# EAGLE design Impression5-SMASH-Shield (EAGLE 9.4.2)
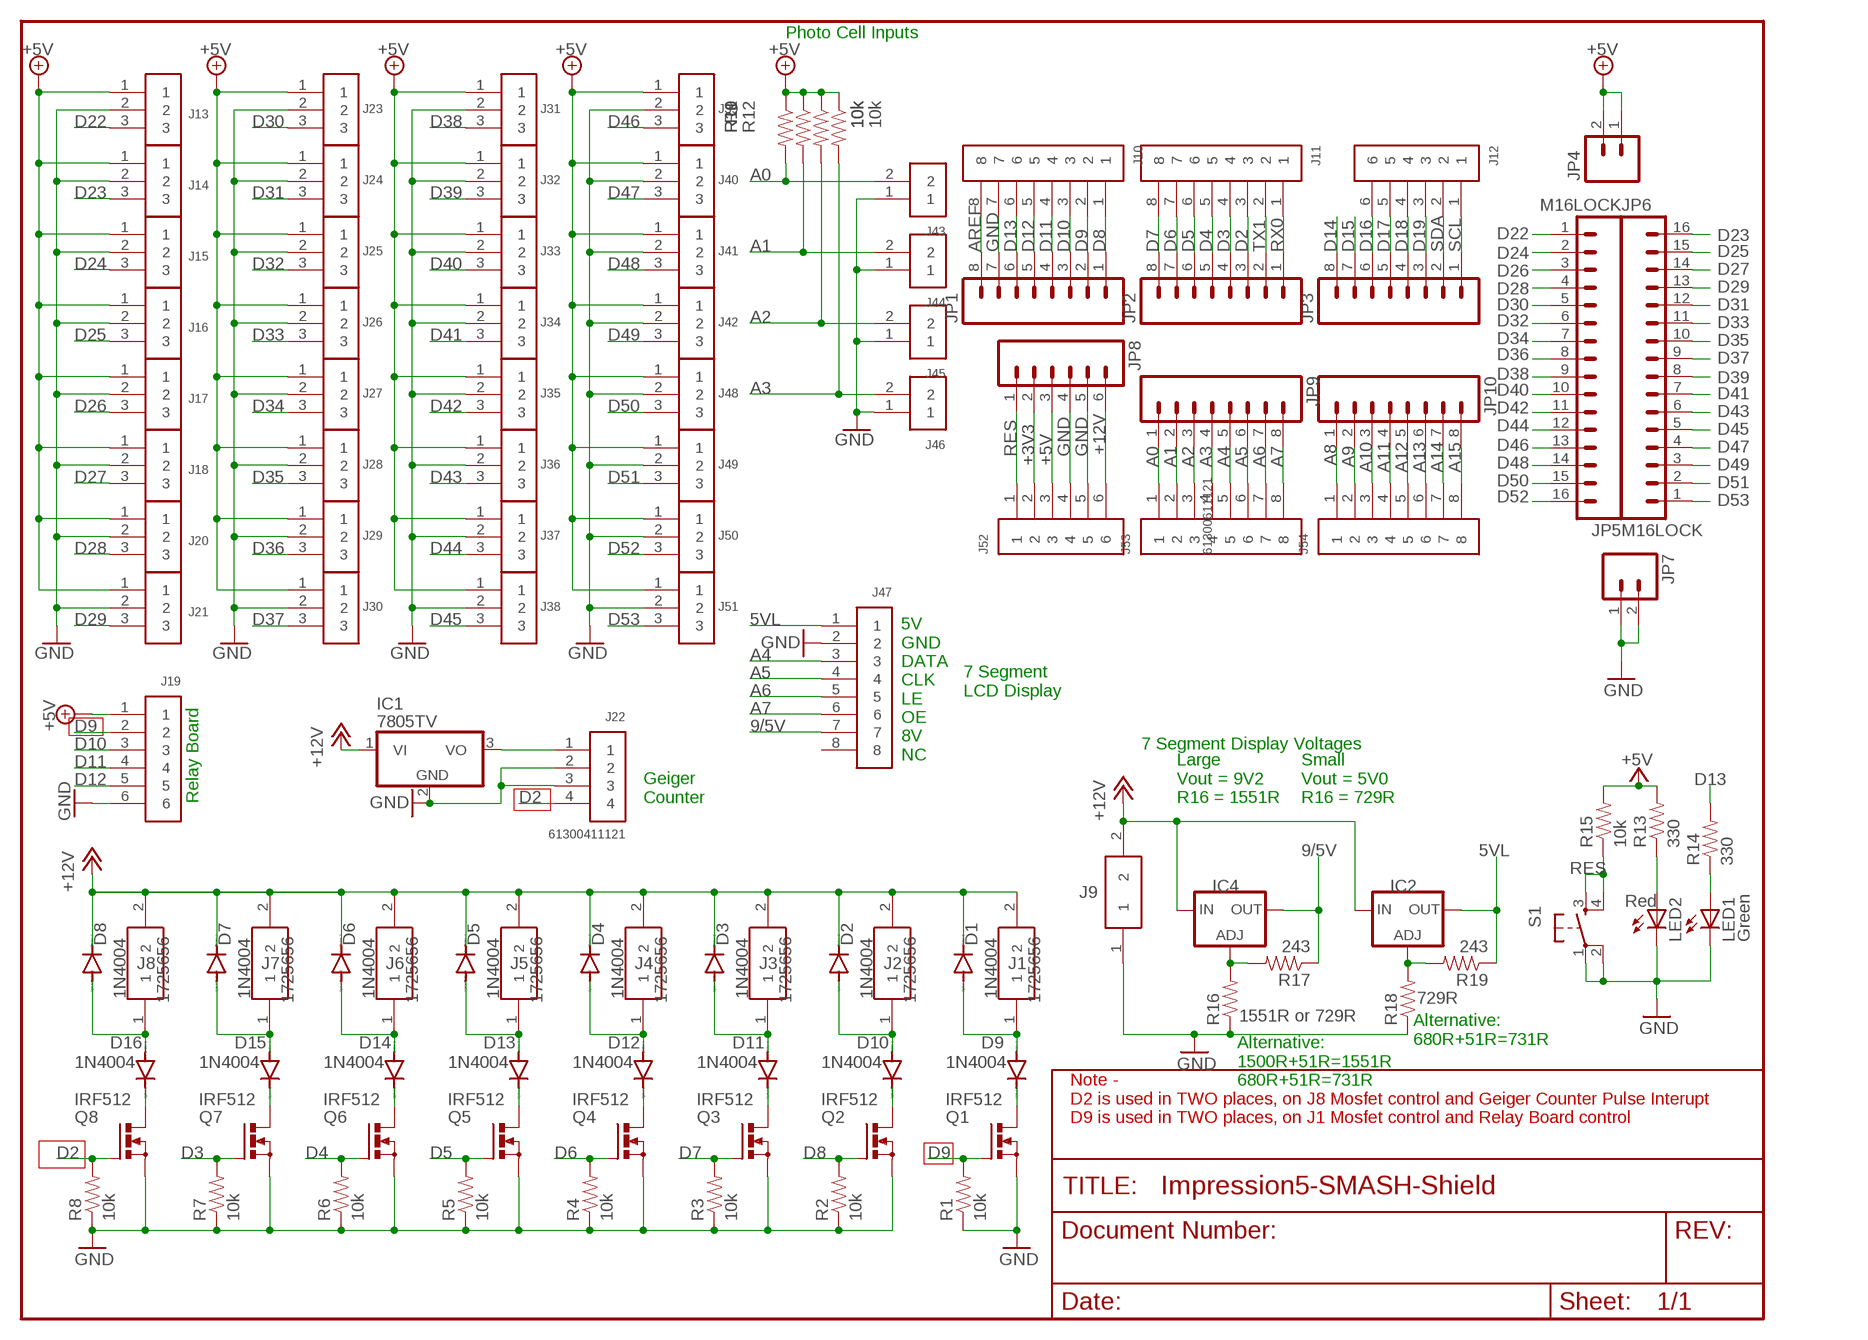
[diagram p0: schematic, sheet 1]

## Parts
D1  1N4004  [DO41-10]
D2  1N4004  [DO41-10]
D3  1N4004  [DO41-10]
D4  1N4004  [DO41-10]
D5  1N4004  [DO41-10]
D6  1N4004  [DO41-10]
D7  1N4004  [DO41-10]
D8  1N4004  [DO41-10]
D9  1N4004  [DO41-10]
D10  1N4004  [DO41-10]
D11  1N4004  [DO41-10]
D12  1N4004  [DO41-10]
D13  1N4004  [DO41-10]
D14  1N4004  [DO41-10]
D15  1N4004  [DO41-10]
D16  1N4004  [DO41-10]
IC1  7805TV  [TO220V]
IC2  LM317TS  [317TS]
IC4  LM317TS  [317TS]
J1  1725656  [1725656]
J2  1725656  [1725656]
J3  1725656  [1725656]
J4  1725656  [1725656]
J5  1725656  [1725656]
J6  1725656  [1725656]
J7  1725656  [1725656]
J8  1725656  [1725656]
J9  1725656  [1725656]
J10  61300811121  [61300811121]
J11  61300811121  [61300811121]
J12  61300611121  [61300611121]
J13  61300311121  [61300311121]
J14  61300311121  [61300311121]
J15  61300311121  [61300311121]
J16  61300311121  [61300311121]
J17  61300311121  [61300311121]
J18  61300311121  [61300311121]
J19  61300611121  [61300611121]
J20  61300311121  [61300311121]
J21  61300311121  [61300311121]
J22  61300411121  [61300411121]
J23  61300311121  [61300311121]
J24  61300311121  [61300311121]
J25  61300311121  [61300311121]
J26  61300311121  [61300311121]
J27  61300311121  [61300311121]
J28  61300311121  [61300311121]
J29  61300311121  [61300311121]
J30  61300311121  [61300311121]
J31  61300311121  [61300311121]
J32  61300311121  [61300311121]
J33  61300311121  [61300311121]
J34  61300311121  [61300311121]
J35  61300311121  [61300311121]
J36  61300311121  [61300311121]
J37  61300311121  [61300311121]
J38  61300311121  [61300311121]
J39  61300311121  [61300311121]
J40  61300311121  [61300311121]
J41  61300311121  [61300311121]
J42  61300311121  [61300311121]
J43  61300211121  [61300211121]
J44  61300211121  [61300211121]
J45  61300211121  [61300211121]
J46  61300211121  [61300211121]
J47  61300811121  [61300811121]
J48  61300311121  [61300311121]
J49  61300311121  [61300311121]
J50  61300311121  [61300311121]
J51  61300311121  [61300311121]
J52  61300611121  [61300611121]
J53  61300811121  [61300811121]
J54  61300811121  [61300811121]
JP1  M08LOCK  [1X08_LOCK]
JP2  M08LOCK  [1X08_LOCK]
JP3  M08LOCK  [1X08_LOCK]
JP4  M02LOCK  [1X02_LOCK]
JP5  M16LOCK  [1X16_LOCK]
JP6  M16LOCK  [1X16_LOCK]
JP7  M02LOCK  [1X02_LOCK]
JP8  M06LOCK  [1X06_LOCK]
JP9  M08LOCK  [1X08_LOCK]
JP10  M08LOCK  [1X08_LOCK]
LED1  Green  LED5MM  [LED5MM]
LED2  Red  LED5MM  [LED5MM]
Q1  IRF512  [TO220BV]
Q2  IRF512  [TO220BV]
Q3  IRF512  [TO220BV]
Q4  IRF512  [TO220BV]
Q5  IRF512  [TO220BV]
Q6  IRF512  [TO220BV]
Q7  IRF512  [TO220BV]
Q8  IRF512  [TO220BV]
R1  10k  RESISTORPTH1  [AXIAL-0.3]
R2  10k  RESISTORPTH1  [AXIAL-0.3]
R3  10k  RESISTORPTH1  [AXIAL-0.3]
R4  10k  RESISTORPTH1  [AXIAL-0.3]
R5  10k  RESISTORPTH1  [AXIAL-0.3]
R6  10k  RESISTORPTH1  [AXIAL-0.3]
R7  10k  RESISTORPTH1  [AXIAL-0.3]
R8  10k  RESISTORPTH1  [AXIAL-0.3]
R9  10k  RESISTORPTH1  [AXIAL-0.3]
R10  10k  RESISTORPTH1  [AXIAL-0.3]
R11  10k  RESISTORPTH1  [AXIAL-0.3]
R12  10k  RESISTORPTH1  [AXIAL-0.3]
R13  330  RESISTORPTH1  [AXIAL-0.3]
R14  330  RESISTORPTH1  [AXIAL-0.3]
R15  10k  RESISTORPTH1  [AXIAL-0.3]
R16  1551R or 729R  RESISTORPTH1  [AXIAL-0.3]
R17  243  RESISTORPTH1  [AXIAL-0.3]
R18  729R  RESISTORPTH1  [AXIAL-0.3]
R19  243  RESISTORPTH1  [AXIAL-0.3]
S1  TAC_SWITCHPTH  [TACTILE-PTH]

## Nets
5VG: IC1.3(VO) J22.1
5VL: IC2.2(OUT) J47.1 R19.P$1
9/5V: IC4.2(OUT) J47.7 R17.P$1
+3V3: J52.2 JP8.2
+5V: J13.1 J14.1 J15.1 J16.1 J17.1 J18.1 J19.1 J20.1 J21.1 J23.1 J24.1 J25.1 J26.1 J27.1 J28.1 J29.1 J30.1 J31.1 J32.1 J33.1 J34.1 J35.1 J36.1 J37.1 J38.1 J39.1 J40.1 J41.1 J42.1 J48.1 J49.1 J50.1 J51.1 J52.3 JP4.1 JP4.2 JP8.3 R9.P$1 R10.P$1 R11.P$1 R12.P$1 R13.P$2 R15.P$2
+12V: D1.C D2.C D3.C D4.C D5.C D6.C D7.C D8.C IC1.1(VI) IC2.3(IN) IC4.3(IN) J1.2 J2.2 J3.2 J4.2 J5.2 J6.2 J7.2 J8.2 J9.2 J52.6 JP8.6
A0: J43.2 J53.1 JP9.1 R9.P$2
A1: J44.2 J53.2 JP9.2 R10.P$2
A2: J45.2 J53.3 JP9.3 R11.P$2
A3: J46.2 J53.4 JP9.4 R12.P$2
A4: J47.3 J53.5 JP9.5
A5: J47.4 J53.6 JP9.6
A6: J47.5 J53.7 JP9.7
A7: J47.6 J53.8 JP9.8
A8: J54.1 JP10.1
A9: J54.2 JP10.2
A10: J54.3 JP10.3
A11: J54.4 JP10.4
A12: J54.5 JP10.5
A13: J54.6 JP10.6
A14: J54.7 JP10.7
A15: J54.8 JP10.8
AREF: J10.8 JP1.8
D2: J11.3 J22.4 JP2.3 Q8.G R8.P$2
D3: J11.4 JP2.4 Q7.G R7.P$2
D4: J11.5 JP2.5 Q6.G R6.P$2
D5: J11.6 JP2.6 Q5.G R5.P$2
D6: J11.7 JP2.7 Q4.G R4.P$2
D7: J11.8 JP2.8 Q3.G R3.P$2
D8: J10.1 JP1.1 Q2.G R2.P$2
D9: J10.2 J19.2 JP1.2 Q1.G R1.P$2
D10: J10.3 J19.3 JP1.3
D11: J10.4 J19.4 JP1.4
D12: J10.5 J19.5 JP1.5
D13: J10.6 JP1.6 R14.P$2
D14: JP3.8
D15: JP3.7
D16: J12.6 JP3.6
D17: J12.5 JP3.5
D18: J12.4 JP3.4
D19: J12.3 JP3.3
D22: J13.3 JP5.1
D23: J14.3 JP6.16
D24: J15.3 JP5.2
D25: J16.3 JP6.15
D26: J17.3 JP5.3
D27: J18.3 JP6.14
D28: J20.3 JP5.4
D29: J21.3 JP6.13
D30: J23.3 JP5.5
D31: J24.3 JP6.12
D32: J25.3 JP5.6
D33: J26.3 JP6.11
D34: J27.3 JP5.7
D35: J28.3 JP6.10
D36: J29.3 JP5.8
D37: J30.3 JP6.9
D38: J31.3 JP5.9
D39: J32.3 JP6.8
D40: J33.3 JP5.10
D41: J34.3 JP6.7
D42: J35.3 JP5.11
D43: J36.3 JP6.6
D44: J37.3 JP5.12
D45: J38.3 JP6.5
D46: J39.3 JP5.13
D47: J40.3 JP6.4
D48: J41.3 JP5.14
D49: J42.3 JP6.3
D50: J48.3 JP5.15
D51: J49.3 JP6.2
D52: J50.3 JP5.16
D53: J51.3 JP6.1
GND: IC1.2(GND) J9.1 J10.7 J13.2 J14.2 J15.2 J16.2 J17.2 J18.2 J19.6 J20.2 J21.2 J22.2 J22.3 J23.2 J24.2 J25.2 J26.2 J27.2 J28.2 J29.2 J30.2 J31.2 J32.2 J33.2 J34.2 J35.2 J36.2 J37.2 J38.2 J39.2 J40.2 J41.2 J42.2 J43.1 J44.1 J45.1 J46.1 J47.2 J48.2 J49.2 J50.2 J51.2 J52.4 J52.5 JP1.7 JP7.1 JP7.2 JP8.4 JP8.5 LED1.K(C) LED2.K(C) Q1.S Q2.S Q3.S Q4.S Q5.S Q6.S Q7.S Q8.S R1.P$1 R2.P$1 R3.P$1 R4.P$1 R5.P$1 R6.P$1 R7.P$1 R8.P$1 R16.P$1 R18.P$1 S1.1 S1.2
N$2: D8.A D16.A J8.1
N$3: D16.C Q8.D
N$5: D7.A D15.A J7.1
N$6: D15.C Q7.D
N$8: D6.A D14.A J6.1
N$9: D14.C Q6.D
N$11: D5.A D13.A J5.1
N$12: D13.C Q5.D
N$14: D4.A D12.A J4.1
N$15: D12.C Q4.D
N$17: D3.A D11.A J3.1
N$18: D11.C Q3.D
N$20: D2.A D10.A J2.1
N$21: D10.C Q2.D
N$23: D1.A D9.A J1.1
N$24: D9.C Q1.D
N$31: IC4.1(ADJ) R16.P$2 R17.P$2
N$41: IC2.1(ADJ) R18.P$2 R19.P$2
N$126: LED2.A R13.P$1
N$127: LED1.A R14.P$1
RES: J52.1 JP8.1 R15.P$1 S1.3 S1.4
RX0: J11.1 JP2.1
SCL: J12.1 JP3.1
SDA: J12.2 JP3.2
TX1: J11.2 JP2.2
Unconnected: J47.8

## Notes on the sheet
- Photo Cell Inputs
- 7 Segment
  LCD Display
- 7 Segment Display Voltages
- 5V
  GND
  DATA
  CLK
  LE
  OE
  8V
  NC
- Relay Board
- Geiger
  Counter
- Large
  Vout = 9V2
  R16 = 1551R
- Small
  Vout = 5V0
  R16 = 729R
- Alternative:
  680R+51R=731R
- Alternative:
  1500R+51R=1551R
  680R+51R=731R
- Note -
  D2 is used in TWO places, on J8 Mosfet control and Geiger Counter Pulse Interupt
  D9 is used in TWO places, on J1 Mosfet control and Relay Board control

## Library data of the parts
D1-D16 = diode:1N4004: DIODE general purpose rectifier, 1 A
IC1 = linear:78*: Positive VOLTAGE REGULATOR Source: http://cache.national.com/ds/LM/LM78L05.pdf http://www.fairchildsemi.com/ds/LM/LM7805.pdf
IC2 IC4 = v-reg:LM317TS: VOLTAGE REGULATOR
J1-J9 = SamacSys_Parts:1725656: 2 way PCB vertical mount terminal,2.54mm 2 way PCB vertical mount terminal,2.54mm Source: Datasheet <https://www.phoenixcontact.com/online/portal/gb?uri=pxc-oc-itemdetail:pid=1725656&library=gben&tab=1>; ALLIED_NUMBER: 70054335; ALLIED_PRICE-STOCK: http://www.alliedelec.com/phoenix-contact-1725656/70054335/; DESCRIPTION: 2 way PCB vertical mount terminal,2.54mm 2 way PCB vertical mount terminal,2.54mm; HEIGHT: 8mm; MANUFACTURER_NAME: Phoenix Contact; MANUFACTURER_PART_NUMBER: 1725656; MOUSER_PART_NUMBER: 651-1725656; MOUSER_PRICE-STOCK: https://www.mouser.com/Search/Refine.aspx?Keyword=651-1725656; RS_PART_NUMBER: 3909023; RS_PRICE-STOCK: https://uk.rs-online.com/web/p/products/3909023
J10 J11 J47 J53 J54 = Headers:61300811121: CONN HEADER VERT 8POS 2.54MM Manufacturer's datasheet <https://katalog.we-online.de/em/datasheet/6130xx11121.pdf>; CREATED_BY: PCBLayout.com; DIGI_KEY_PART_NUMBER: 732-5321-ND; MANUFACTURER: Wurth Electronics Inc.; MPN: 61300811121
J12 J19 J52 = Headers:61300611121: CONN HEADER VERT 6POS 2.54MM Manufacturer's datasheet <https://katalog.we-online.de/em/datasheet/6130xx11121.pdf>; CREATED_BY: PCBLayout.com; DIGI_KEY_PART_NUMBER: 732-5319-ND; MANUFACTURER: Wurth Electronics Inc.; MPN: 61300611121
J13-J18 J20 J21 J23-J42 J48-J51 = Headers:61300311121: CONN HEADER VERT 3POS 2.54MM Manufacturer's datasheet <https://katalog.we-online.de/em/datasheet/6130xx11121.pdf>; CREATED_BY: PCBLayout.com; DIGI_KEY_PART_NUMBER: 732-5316-ND; MANUFACTURER: Wurth Electronics Inc.; MPN: 61300311121
J22 = Headers:61300411121: CONN HEADER VERT 4POS 2.54MM Manufacturer's datasheet <https://katalog.we-online.de/em/datasheet/6130xx11121.pdf>; CREATED_BY: PCBLayout.com; DIGI_KEY_PART_NUMBER: 732-5317-ND; MANUFACTURER: Wurth Electronics Inc.; MPN: 61300411121
J43-J46 = Headers:61300211121: CONN HEADER VERT 2POS 2.54MM Manufacturer's datasheet <https://katalog.we-online.de/em/datasheet/6130xx11121.pdf>; CREATED_BY: PCBLayout.com; DIGI_KEY_PART_NUMBER: 732-5315-ND; MANUFACTURER: Wurth Electronics Inc.; MPN: 61300211121
JP1-JP3 JP9 JP10 = SparkFun:M08: Header 8 Standard 8-pin 0.1" header. Use with straight break away headers (SKU : PRT-00116), right angle break away headers (PRT-00553), swiss pins (PRT-00743), machine pins (PRT-00117), and female headers (PRT-00115).
JP4 JP7 = SparkFun:M02: Header 2 Standard 2-pin 0.1" header. Use with straight break away headers (SKU : PRT-00116), right angle break away headers (PRT-00553), swiss pins (PRT-00743), machine pins (PRT-00117), and female headers (PRT-00115). Molex polarized connector foot print use with SKU : PRT-08233 with associated crimp pins and housings.
JP5 JP6 = SparkFun:M16
JP8 = SparkFun:M06: Header 6 Standard 6-pin 0.1" header. Use with straight break away headers (SKU : PRT-00116), right angle break away headers (PRT-00553), swiss pins (PRT-00743), machine pins (PRT-00117), and female headers (PRT-00115). Molex polarized connector foot print use with SKU : PRT-08094 with associated crimp pins and housings. NOTES ON THE VARIANTS LOCK and LOCK_LONGPADS... This footprint was designed to help hold the alignment of a through-hole component (i.e. 6-pin header) while soldering it into place. You may notice that each hole has been shifted either up or down by 0.005 of an inch from it's more standard position (which is a perfectly straight line). This slight alteration caused the pins (the squares in the middle) to touch the edges of the holes. Because they are alternating, it causes a "brace" to hold the component in place. 0.005 has proven to be the perfect amount of "off-center" position when using our standard breakaway headers. Although looks a little odd when you look at the bare footprint, once you have a header in there, the alteration is very hard to notice. Also, if you push a header all the way into place, it is covered up entirely on the bottom side. This idea of altering the position of holes to aid alignment will be further integrated into the Sparkfun Library for other footprints. It can help hold any component with 3 or more connection pins.
LED1 LED2 = SparkFun:LED: LEDs Standard schematic elements and footprints for 5mm, 3mm, 1206, and 0603 sized LEDs. 5mm - Spark Fun Electronics SKU : COM-00529 (and others)
Q1-Q8 = transistor-power:IRF512: N-CHANNEL MOS FET
R1-R19 = SparkFun:RESISTOR: Resistor Basic schematic elements and footprints for 0603, 1206, and PTH 1/10th watt (small) resistors.
S1 = SparkFun:TAC_SWITCH: Momentary Switch Button commonly used for reset or general input. Spark Fun Electronics SKU : COM-00097

## Board
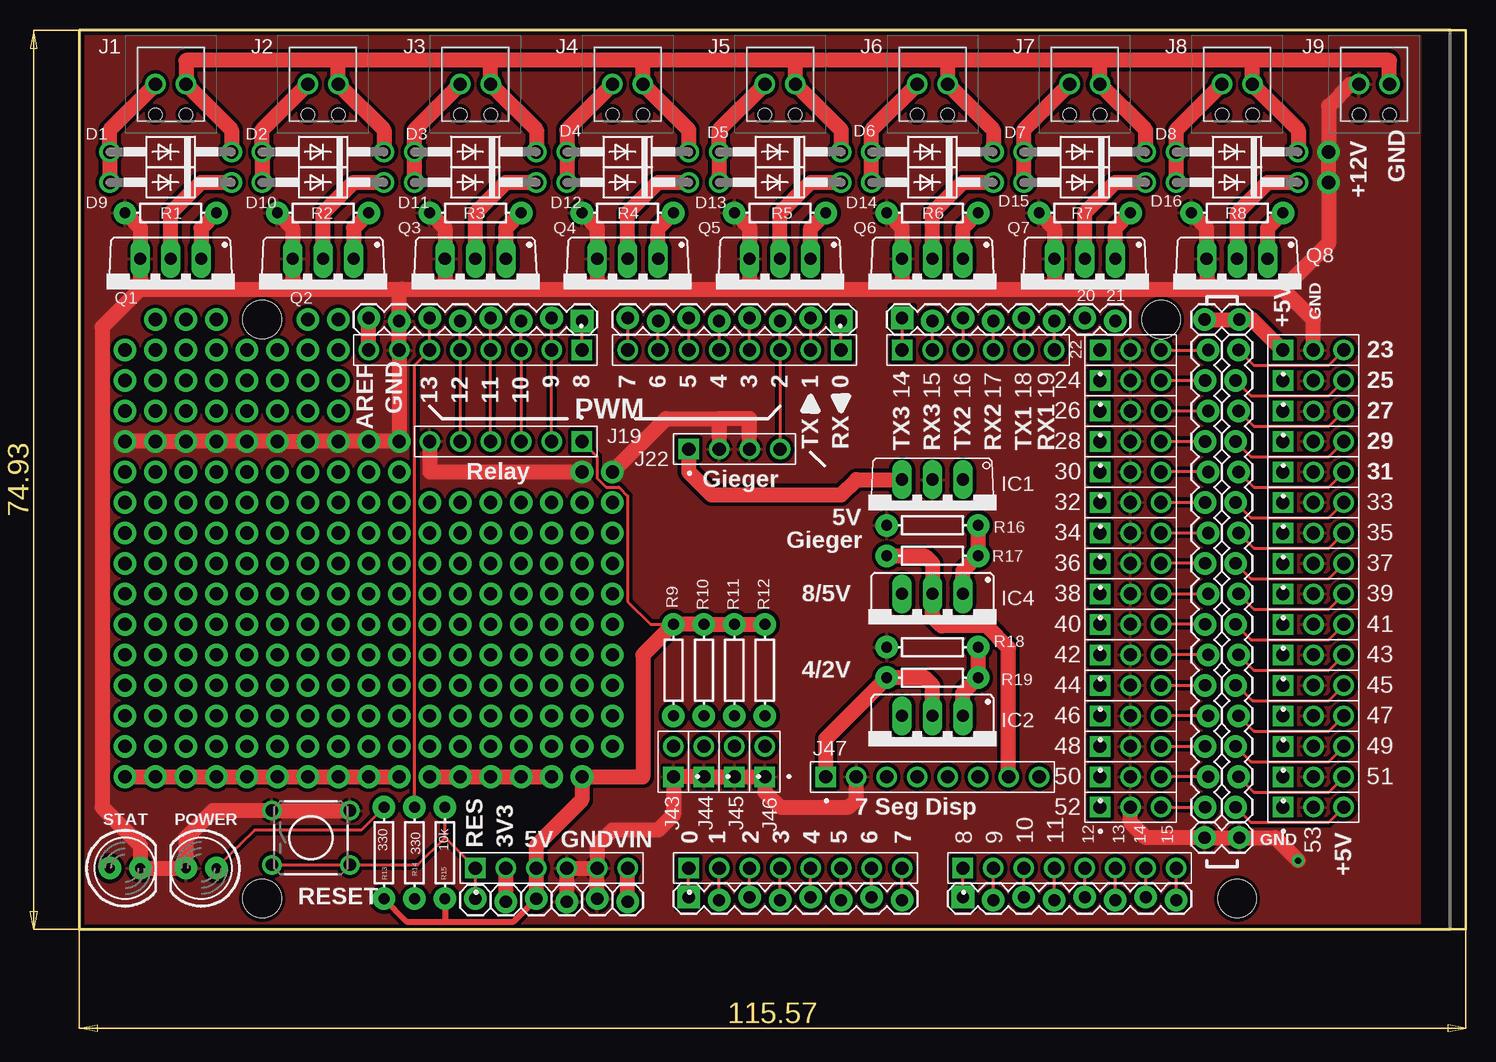
[diagram p1: board, top side]
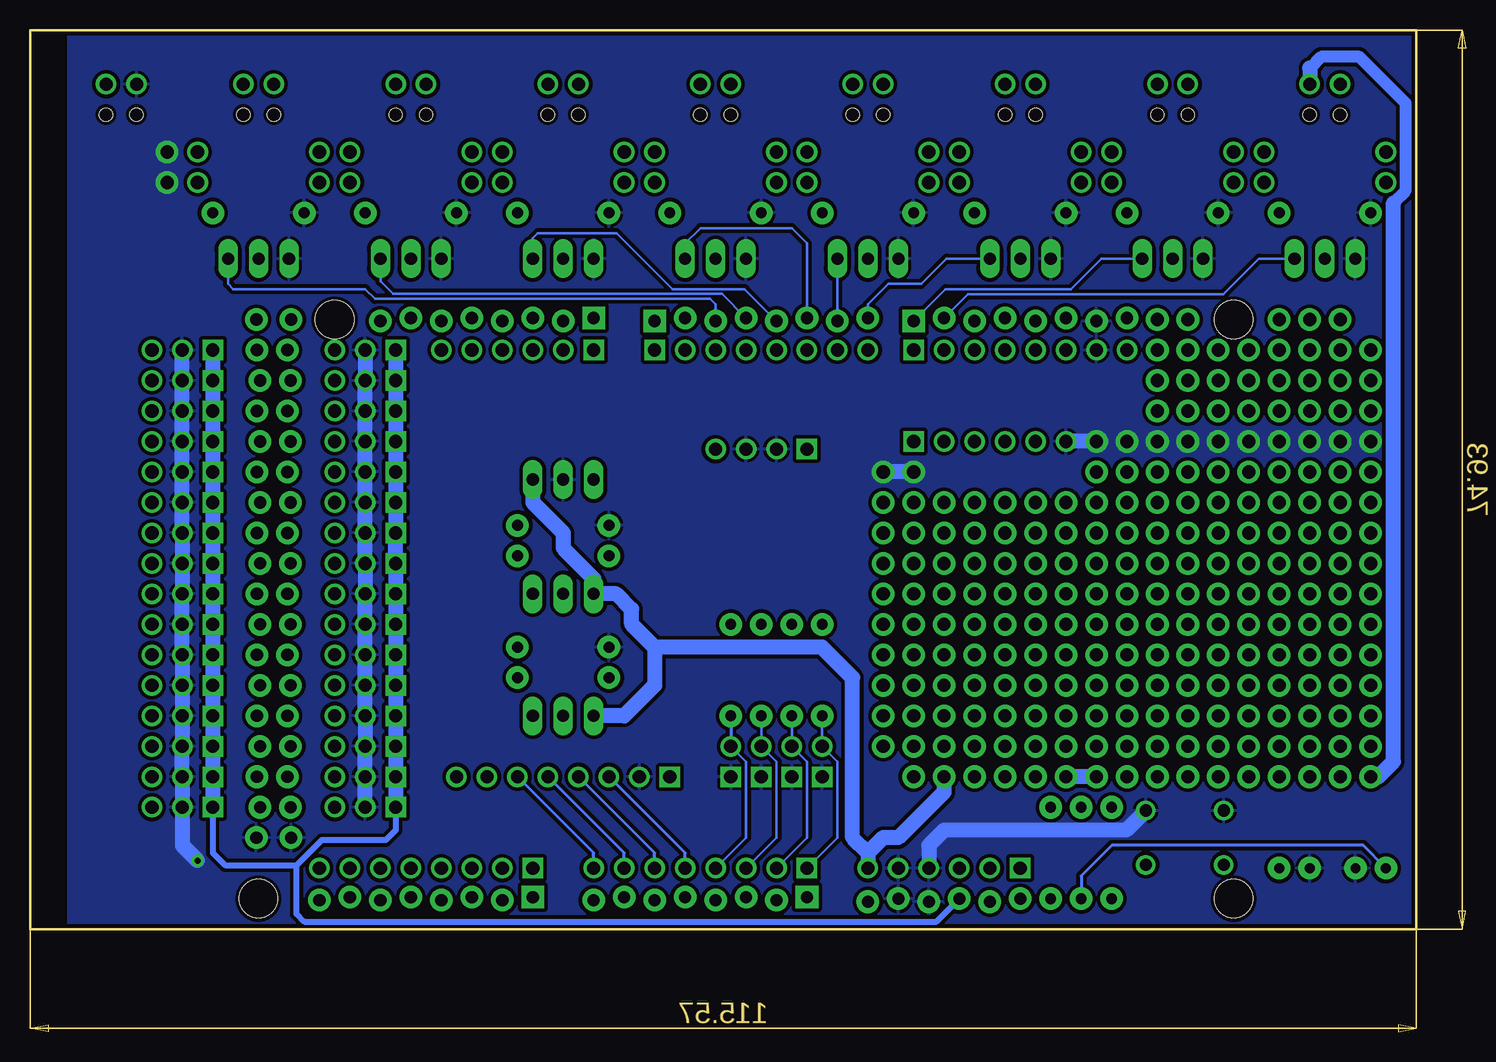
[diagram p2: board, bottom side, seen from below]

Size 115.57 x 74.93 mm. Coordinates in mm from the lower left corner, seen from the top.
Outline: 0,0 115.57,0 115.57,74.93 0,74.93 0,0
Copper layers (1*16): Top 0.035mm / dielectric 1.5mm / Bottom 0.035mm
Design rules "SparkFun *": minimum track width 8mil, minimum drill 20mil, track to track 8mil, track to pad 8mil, pad to pad 8mil, via to via 8mil, smd to smd 8mil, copper to edge 10mil, drill to drill 8mil, minimum pad ring 12mil, minimum via ring 10mil, stop-mask expansion 4mil, vias tented up to drill 25mil, thermal gap 10mil
Holes 3.2 mm at 15.24,50.8 15.24,2.54 90.17,50.8 96.52,2.54

### Footprints (pad centres in the part's own frame; a part is rotated, then mirrored left to right if it is on the bottom)
DO41-10 = drill 1.118: A 5.08,0; C -5.08,0
TO220V = drill 1.016 long: 1 -2.54,-2.54; 2 0,-2.54; 3 2.54,-2.54
317TS = drill 1.016 long: 1 -2.54,-2.54; 2 0,-2.54; 3 2.54,-2.54
1725656 = drill 1.1 pad 1.65: 1 -1.27,3.1; 2 1.27,3.1 | hole 1.1: -1.27,0.56; 1.27,0.56
61300811121 = drill 1.1 square: 1 -8.89,0 | drill 1.1: 2 -6.35,0; 3 -3.81,0; 4 -1.27,0; 5 1.27,0; 6 3.81,0; 7 6.35,0; 8 8.89,0
61300611121 = drill 1.1 square: 1 -6.35,0 | drill 1.1: 2 -3.81,0; 3 -1.27,0; 4 1.27,0; 5 3.81,0; 6 6.35,0
61300311121 = drill 1.1 square: 1 -2.54,0 | drill 1.1: 2 0,0; 3 2.54,0
61300411121 = drill 1.1 square: 1 -3.81,0 | drill 1.1: 2 -1.27,0; 3 1.27,0; 4 3.81,0
61300211121 = drill 1.1 square: 1 -1.27,0 | drill 1.1: 2 1.27,0
1X08_LOCK = drill 1.016 pad 1.88 square: 1 0,0.127 | drill 1.016 pad 1.88: 2 2.54,-0.127; 3 5.08,0.127; 4 7.62,-0.127; 5 10.16,0.127; 6 12.7,-0.127; 7 15.24,0.127; 8 17.78,-0.127
1X02_LOCK = drill 1.016 pad 1.88: 1 -0.178,0; 2 2.718,0
1X16_LOCK = drill 1.016 pad 1.88: 1 0,0.127; 2 2.54,-0.127; 3 5.08,0.127; 4 7.62,-0.127; 5 10.16,0.127; 6 12.7,-0.127; 7 15.24,0.127; 8 17.78,-0.127; 9 20.32,0.127; 10 22.86,-0.127; 11 25.4,0.127; 12 27.94,-0.127; 13 30.48,0.127; 14 33.02,-0.127; 15 35.56,0.127; 16 38.1,-0.127
1X06_LOCK = drill 1.016 pad 1.88: 1 0,0; 2 2.54,-0.254; 3 5.08,0; 4 7.62,-0.254; 5 10.16,0; 6 12.7,-0.254
LED5MM = drill 0.813 pad 1.88: A -1.27,0; K 1.27,0
TO220BV = drill 1.016 long: D 0,-2.54; G -2.54,-2.54; S 2.54,-2.54
AXIAL-0.3 = drill 0.9 pad 1.88: P$1 -3.81,0; P$2 3.81,0
TACTILE-PTH = drill 1.016: 1 -3.251,2.261; 2 3.251,2.261; 3 -3.251,-2.261; 4 3.251,-2.261

### Placement (x,y rotation side)
D1  7.62,64.77 180 top
D2  20.32,64.77 180 top
D3  33.02,64.77 180 top
D4  45.72,64.77 180 top
D5  58.42,64.77 180 top
D6  71.12,64.77 180 top
D7  83.82,64.77 180 top
D8  96.52,64.77 180 top
D9  7.62,62.23 180 top
D10  20.32,62.23 180 top
D11  33.02,62.23 180 top
D12  45.72,62.23 180 top
D13  58.42,62.23 180 top
D14  71.12,62.23 180 top
D15  83.82,62.23 180 top
D16  96.52,62.23 180 top
IC1  71.12,34.92 180 top
IC2  71.12,15.24 180 top
IC4  71.12,25.4 180 top
J1  7.62,67.31 0 top
J2  20.32,67.31 0 top
J3  33.02,67.31 0 top
J4  45.72,67.31 0 top
J5  58.42,67.31 0 top
J6  71.12,67.31 0 top
J7  83.82,67.31 0 top
J8  96.52,67.31 0 top
J9  107.95,67.31 0 top
J10  33.02,48.26 180 top
J11  54.61,48.26 180 top
J12  74.93,48.26 0 top
J13  87.63,48.26 0 top
J14  102.87,48.26 0 top
J15  87.63,45.72 0 top
J16  102.87,45.72 0 top
J17  87.63,43.18 0 top
J18  102.87,43.18 0 top
J19  35.56,40.64 180 top
J20  87.63,40.64 0 top
J21  102.87,40.64 0 top
J22  54.61,40.01 0 top
J23  87.63,38.1 0 top
J24  102.87,38.1 0 top
J25  87.63,35.56 0 top
J26  102.87,35.56 0 top
J27  87.63,33.02 0 top
J28  102.87,33.02 0 top
J29  87.63,30.48 0 top
J30  102.87,30.48 0 top
J31  87.63,27.94 0 top
J32  102.87,27.94 0 top
J33  87.63,25.4 0 top
J34  102.87,25.4 0 top
J35  87.63,22.86 0 top
J36  102.87,22.86 0 top
J37  87.63,20.32 0 top
J38  102.87,20.32 0 top
J39  87.63,17.78 0 top
J40  102.87,17.78 0 top
J41  87.63,15.24 0 top
J42  102.87,15.24 0 top
J43  49.53,13.97 90 top
J44  52.07,13.97 90 top
J45  54.61,13.97 90 top
J46  57.15,13.97 90 top
J47  71.12,12.7 0 top
J48  87.63,12.7 0 top
J49  102.87,12.7 0 top
J50  87.63,10.16 0 top
J51  102.87,10.16 0 top
J52  39.37,5.08 0 top
J53  59.69,5.08 0 top
J54  82.55,5.08 0 top
JP1  41.91,50.8 180 top
JP2  63.5,50.8 180 top
JP3  68.58,50.8 0 top
JP4  93.98,50.8 0 top
JP5  93.98,48.26 270 top
JP6  96.52,10.16 90 top
JP7  93.98,7.62 0 top
JP8  33.02,2.54 0 top
JP9  50.8,2.54 0 top
JP10  73.66,2.54 0 top
LED1  3.81,5.08 0 top
LED2  10.16,5.08 180 top
Q1  7.62,53.34 180 top
Q2  20.32,53.34 180 top
Q3  33.02,53.34 180 top
Q4  45.72,53.34 180 top
Q5  58.42,53.34 180 top
Q6  71.12,53.34 180 top
Q7  83.82,53.34 180 top
Q8  96.52,53.34 180 top
R1  7.62,59.69 0 top
R2  20.32,59.69 0 top
R3  33.02,59.69 0 top
R4  45.72,59.69 0 top
R5  58.42,59.69 0 top
R6  71.12,59.69 0 top
R7  83.82,59.69 0 top
R8  96.52,59.69 0 top
R9  49.53,21.59 270 top
R10  52.07,21.59 270 top
R11  54.61,21.59 270 top
R12  57.15,21.59 270 top
R13  25.4,6.35 270 top
R14  27.94,6.35 90 top
R15  30.48,6.35 270 top
R16  71.12,33.66 0 top
R17  71.12,31.11 0 top
R18  71.12,23.5 0 top
R19  71.12,20.95 0 top
S1  19.3,7.62 0 top

### Tracks (layer width: path | path; a pad name or v marks a point on that pad's centre or on a via)
5VG
  Top 1.27: J22.1 50.8,38.1 52.7,36.2 63.5,36.2 64.77,37.47 IC1.3
5VL
  Top 1.27: IC2.2 71.12,20.32 70.48,20.95 R19.P$1 62.23,15.88 J47.1
9/5V
  Top 1.27: R17.P$1 70.48,31.11 71.12,30.48 IC4.2 71.12,26.04 71.88,25.27 75.67,25.27 77.47,23.47 J47.7
+3V3
  Top 1.27: JP8.2 J52.2
+5V  (via drill 1.1 pad 1.88)
  Top 0.254: R9.P$1 47.62,25.4 45.72,27.3 45.72,36.09 44.98,36.83 43.92,36.83 43.18,37.57 43.18,39.37 J19.1
  Top 0.508: R13.P$2 27.3,0.64 30.48,0.64 | JP8.3 36.2,0.64 30.48,0.64 | R15.P$2 30.48,0.64
  Top 1.27: JP4.1 JP4.2 97.79,50.8 J14.1 | JP8.3 J52.3 38.1,6.99 41.91,10.79 v41.91,12.7 46.99,12.7 46.99,22.86 R9.P$1 R10.P$1 R11.P$1 R12.P$1
  Bottom 0.508: 93.34,5.33 91.25,7.43 85.92,7.43 85.09,8.26 J50.1 | 93.34,5.33 93.34,1.27 92.71,0.64 40.01,0.64 JP8.3 | J51.1 100.33,6.35 99.31,5.33 93.34,5.33
  Bottom 1.27: J13.1 J15.1 J17.1 J20.1 J23.1 J25.1 J27.1 J29.1 J31.1 J33.1 J35.1 J37.1 J39.1 J41.1 J48.1 J50.1 | J14.1 J16.1 J18.1 J21.1 J24.1 J26.1 J28.1 J30.1 J32.1 J34.1 J36.1 J38.1 J40.1 J42.1 J49.1 J51.1
+12V  (via drill 1.1 pad 1.88)
  Top 1.27: D1.C 12.7,66.6 J1.2 8.89,72.39 21.59,72.39 | D2.C 25.4,66.6 J2.2 21.59,72.39 | D3.C 38.1,66.6 J3.2 34.29,72.39 | D4.C 50.8,66.6 J4.2 46.99,72.39 | D5.C 63.5,66.6 J5.2 59.69,72.39 | D6.C 76.2,66.6 J6.2 72.39,72.39 | D7.C 88.9,66.6 J7.2 85.09,72.39 | D8.C 101.6,66.6 J8.2 97.79,72.39 | 97.79,72.39 85.09,72.39 | 85.09,72.39 72.39,72.39 | 72.39,72.39 59.69,72.39 | 59.69,72.39 46.99,72.39 | 46.99,72.39 34.29,72.39 | 34.29,72.39 21.59,72.39 | J9.2 109.22,72.39 97.79,72.39 | JP8.6 J52.6 | v3.81,12.7 v6.35,12.7 v8.89,12.7 v11.43,12.7 v13.97,12.7 v16.51,12.7 v19.05,12.7 v21.59,12.7 v24.13,12.7 v26.67,12.7 | v29.21,12.7 v31.75,12.7 v34.29,12.7 v36.83,12.7 v39.37,12.7
  Bottom 1.016: 1.91,60.53 0.89,61.55 0.89,68.83 4.74,72.69 7.96,72.69 8.89,71.75
  Bottom 1.27: 1.91,60.53 1.91,13.97 3.17,12.7 v3.81,12.7 | 8.89,71.75 J1.2 | v39.37,12.7 39.37,11.43 43.18,7.62 44.45,7.62 45.72,6.35 | 45.72,6.35 J52.6 | v26.67,12.7 v29.21,12.7 | 45.72,6.35 46.99,7.62 46.99,20.95 49.53,23.5 63.5,23.5 | 63.5,23.5 65.41,25.4 65.41,26.67 66.67,27.94 IC4.3 68.58,29.21 71.12,31.75 71.12,33.02 73.66,35.56 IC1.1 | 63.5,23.5 63.5,20.32 66.04,17.78 IC2.3
A0
  Top 0.254: JP9.1 J53.1
  Bottom 0.203: R9.P$2 J43.2 48.26,13.97 48.26,7.62 J53.1
A1
  Top 0.254: JP9.2 J53.2
  Bottom 0.203: R10.P$2 J44.2 50.8,13.97 50.8,7.62 J53.2
A2
  Top 0.254: JP9.3 J53.3
  Bottom 0.203: R11.P$2 J45.2 53.34,13.97 53.34,7.62 J53.3
A3
  Top 0.254: JP9.4 J53.4
  Bottom 0.203: J53.4 55.88,7.62 55.88,13.97 J46.2
  Bottom 0.254: R12.P$2 J46.2
A4
  Top 0.254: JP9.5 J53.5
  Bottom 0.254: J53.5 60.96,6.35 J47.3
A5
  Top 0.254: JP9.6 J53.6
  Bottom 0.254: J53.6 63.5,6.35 J47.4
A6
  Top 0.254: JP9.7 J53.7
  Bottom 0.254: J53.7 66.04,6.35 J47.5
A7
  Top 0.254: JP9.8 J53.8
  Bottom 0.254: J53.8 68.58,6.35 J47.6
A8
  Top 0.254: JP10.1 J54.1
A9
  Top 0.254: JP10.2 J54.2
A10
  Top 0.254: JP10.3 J54.3
A11
  Top 0.254: JP10.4 J54.4
A12
  Top 0.254: JP10.5 J54.5
A13
  Top 0.254: JP10.6 J54.6
A14
  Top 0.254: JP10.7 J54.7
A15
  Top 0.254: JP10.8 J54.8
AREF
  Top 1.27: J10.8 JP1.8
D2
  Top 0.254: JP2.3 J11.3 J22.4
  Top 1.27: Q8.G 99.06,58.42 R8.P$2
  Bottom 0.203: Q8.G 99.06,53.76 98.64,53.34 87.63,53.34 86.82,52.53 58.88,52.53 58.42,52.07 JP2.3
D3
  Top 0.254: J11.4 JP2.4
  Top 1.27: Q7.G 86.36,58.42 R7.P$2
  Bottom 0.203: JP2.4 57.89,52.93 85.32,52.93 86.36,53.98 Q7.G
D4
  Top 0.254: JP2.5 J11.5
  Top 1.27: Q6.G 73.66,58.42 R6.P$2
  Bottom 0.203: JP2.5 56.01,53.34 62.02,53.34 66.67,58 73.24,58 73.66,57.57 Q6.G
D5
  Top 0.254: JP2.6 J11.6
  Top 1.27: Q5.G 60.96,58.42 R5.P$2
  Bottom 0.203: JP2.6 50.8,57.15 52.07,58.42 59.69,58.42 60.96,57.15 Q5.G
D6
  Top 0.254: J11.7 JP2.7
  Top 1.27: Q4.G 48.26,58.42 R4.P$2
  Bottom 0.203: JP2.7 Q4.G
D7
  Top 0.254: JP2.8 J11.8
  Top 1.27: Q3.G 35.56,58.42 R3.P$2
  Bottom 0.203: JP2.8 45.72,52.07 44.03,53.76 41.27,53.76 39.16,55.88 Q3.G
D8
  Top 0.254: J10.1 JP1.1
  Top 1.27: R2.P$2 22.86,58.42 Q2.G
  Bottom 0.203: JP1.1 39.24,53.34 28.79,53.34 26.25,55.88 Q2.G
D9
  Top 0.254: JP1.2 39.37,48.9 J10.2 J19.2
  Top 1.27: Q1.G 10.16,58.42 R1.P$2
  Bottom 0.203: JP1.2 37.38,52.92 16.09,52.92 13.12,55.88 Q1.G
D10
  Top 0.254: JP1.3 J10.3 J19.3
D11
  Top 0.254: JP1.4 J10.4 J19.4
D12
  Top 0.254: JP1.5 J10.5 J19.5
D13
  Top 0.254: JP1.6 J10.6 27.94,46.99 R14.P$2
D16
  Top 0.254: J12.6 JP3.6
D17
  Top 0.254: JP3.5 J12.5
D18
  Top 0.254: J12.4 JP3.4
D19
  Top 0.254: JP3.3 J12.3
D22
  Top 0.254: J13.3 JP5.1
D23
  Top 0.254: JP6.16 97.92,46.99 104.14,46.99 J14.3
D24
  Top 0.254: JP5.2 J15.3
D25
  Top 0.254: JP6.15 97.66,44.45 104.14,44.45 J16.3
D26
  Top 0.254: JP5.3 J17.3
D27
  Top 0.254: JP6.14 97.92,41.91 104.14,41.91 J18.3
D28
  Top 0.254: J20.3 JP5.4
D29
  Top 0.254: JP6.13 97.66,39.37 104.14,39.37 J21.3
D30
  Top 0.254: JP5.5 J23.3
D31
  Top 0.254: JP6.12 97.92,36.83 104.14,36.83 J24.3
D32
  Top 0.254: J25.3 JP5.6
D33
  Top 0.254: JP6.11 97.66,34.29 104.14,34.29 J26.3
D34
  Top 0.254: J27.3 JP5.7
D35
  Top 0.254: JP6.10 97.92,31.75 104.14,31.75 J28.3
D36
  Top 0.254: JP5.8 J29.3
D37
  Top 0.254: JP6.9 97.66,29.21 104.14,29.21 J30.3
D38
  Top 0.254: J31.3 JP5.9
D39
  Top 0.254: JP6.8 97.92,26.67 104.14,26.67 J32.3
D40
  Top 0.254: JP5.10 J33.3
D41
  Top 0.254: JP6.7 97.66,24.13 104.14,24.13 J34.3
D42
  Top 0.254: JP5.11 J35.3
D43
  Top 0.254: JP6.6 97.92,21.59 104.14,21.59 J36.3
D44
  Top 0.254: J37.3 JP5.12
D45
  Top 0.254: JP6.5 96.52,20.32 97.79,19.05 104.14,19.05 J38.3
D46
  Top 0.254: JP5.13 J39.3
D47
  Top 0.254: JP6.4 97.92,16.51 104.14,16.51 J40.3
D48
  Top 0.254: J41.3 JP5.14
D49
  Top 0.254: JP6.3 97.66,13.97 104.14,13.97 J42.3
D50
  Top 0.254: JP5.15 J48.3
D51
  Top 0.254: JP6.2 97.92,11.43 104.14,11.43 J49.3
D52
  Top 0.254: J50.3 JP5.16
D53
  Top 0.254: JP6.1 97.66,8.89 104.14,8.89 J51.3
GND  (via drill 0.51 pad 0.6, 1.1 pad 1.88)
  Top 1.27: 5.08,53.34 Q1.S 5.08,58.42 R1.P$1 | 5.08,53.34 17.78,53.34 | 17.78,53.34 26.88,53.34 | 26.88,53.34 30.48,53.34 | 30.48,53.34 43.18,53.34 | 43.18,53.34 55.88,53.34 | 55.88,53.34 68.58,53.34 | 68.58,53.34 81.28,53.34 | 81.28,53.34 93.98,53.34 | 93.98,53.34 Q8.S 93.98,58.42 R8.P$1 | 81.28,53.34 Q7.S 81.28,58.42 R7.P$1 | R6.P$1 68.58,58.42 Q6.S 68.58,53.34 | 55.88,53.34 Q5.S 55.88,58.42 R5.P$1 | 43.18,53.34 Q4.S 43.18,58.42 R4.P$1 | R3.P$1 30.48,58.42 Q3.S 30.48,53.34 | 17.78,53.34 Q2.S 17.78,58.42 R2.P$1 | 26.88,53.34 26.67,53.13 JP1.7 J10.7 v26.67,40.64 v24.13,40.64 v21.59,40.64 v19.05,40.64 v16.51,40.64 v13.97,40.64 v11.43,40.64 v8.89,40.64 v6.35,40.64 v3.81,40.64 | J9.1 105.97,70.41 104.14,68.58 v104.14,64.77 v104.14,62.23 104.14,57.15 100.33,53.34 | 100.33,53.34 93.98,53.34 | JP8.4 J52.4 J52.5 | S1.2 S1.1 11.15,9.88 8.89,7.62 LED2.K LED1.K 5.08,6.99 1.91,10.16 1.91,50.16 5.08,53.34 | JP8.5 J52.5 | v41.91,38.1 29.21,38.1 J19.6 | J50.2 87.63,8.89 88.9,7.62 JP7.1 JP7.2 99.69,7.62 v101.6,5.71 | J14.2 102.87,50.8 100.33,53.34 | J52.5 43.18,6.99 44.45,8.26 48.26,8.26 49.53,9.53 J43.1 J44.1 J45.1 J46.1 57.15,11.43 58.42,10.16 64.14,10.16 64.77,10.79 J47.2 | v44.45,38.1 48.9,42.55 53.34,42.55 | 53.34,42.55 J22.2 | J22.3 55.88,42.55 53.34,42.55
  Bottom 1.27: S1.2 24.18,8.26 39.37,8.26 40.64,6.99 J52.4 | v26.67,40.64 J19.6 | J13.2 J15.2 J17.2 J20.2 J23.2 J25.2 J27.2 J29.2 J31.2 J33.2 J35.2 J37.2 J39.2 J41.2 J48.2 J50.2 | J14.2 J16.2 J18.2 J21.2 J24.2 J26.2 J28.2 J30.2 J32.2 J34.2 J36.2 J38.2 J40.2 J42.2 J49.2 J51.2 102.87,6.99 v101.6,5.71 | v41.91,38.1 v44.45,38.1
  pour Bottom (isolate 0.305): 0,0 112.39,0 112.39,74.93 0,74.93
  pour Top (isolate 0.305): 0,0 111.76,0 111.76,74.93 0,74.93
N$1  (via drill 1.1 pad 1.88)
  other vias: 21.59,45.72
N$2
  Top 1.27: J8.1 91.44,66.6 D8.A D16.A
N$3
  Top 1.27: Q8.D 96.52,59.69 99.06,62.23 D16.C
N$4  (via drill 1.1 pad 1.88)
  other vias: 6.35,43.18
N$5
  Top 1.27: J7.1 78.74,66.6 D7.A D15.A
N$6
  Top 1.27: Q7.D 83.82,59.69 86.36,62.23 D15.C
N$7  (via drill 1.1 pad 1.88)
  other vias: 13.97,45.72
N$8
  Top 1.27: J6.1 66.04,66.6 D6.A D14.A
N$9
  Top 1.27: Q6.D 71.12,59.69 73.66,62.23 D14.C
N$10  (via drill 1.1 pad 1.88)
  other vias: 21.59,38.1
N$11
  Top 1.27: J5.1 53.34,66.6 D5.A D13.A
N$12
  Top 1.27: Q5.D 58.42,59.69 60.96,62.23 D13.C
N$13  (via drill 1.1 pad 1.88)
  other vias: 16.51,35.56
N$14
  Top 1.27: J4.1 40.64,66.6 D4.A D12.A
N$15
  Top 1.27: Q4.D 45.72,59.69 48.26,62.23 D12.C
N$16  (via drill 1.1 pad 1.88)
  other vias: 21.59,33.02
N$17
  Top 1.27: J3.1 27.94,66.6 D3.A D11.A
N$18
  Top 1.27: Q3.D 33.02,59.69 35.56,62.23 D11.C
N$19  (via drill 1.1 pad 1.88)
  other vias: 11.43,30.48
N$20
  Top 1.27: J2.1 15.24,66.6 D2.A D10.A
N$21
  Top 1.27: Q2.D 20.32,59.69 22.86,62.23 D10.C
N$22  (via drill 1.1 pad 1.88)
  other vias: 21.59,27.94
N$23
  Top 1.27: J1.1 2.54,66.6 D1.A D9.A
N$24
  Top 1.27: Q1.D 7.62,59.69 10.16,62.23 D9.C
N$25  (via drill 1.1 pad 1.88)
  other vias: 11.43,25.4
N$26  (via drill 1.1 pad 1.88)
  other vias: 21.59,22.86
N$27  (via drill 1.1 pad 1.88)
  other vias: 21.59,20.32
N$28  (via drill 1.1 pad 1.88)
  other vias: 21.59,17.78
N$29  (via drill 1.1 pad 1.88)
  other vias: 6.35,15.24
N$30  (via drill 1.1 pad 1.88)
  other vias: 16.51,45.72
N$31
  Top 1.27: R16.P$2 R17.P$2 73.66,29.84 IC4.1
N$32  (via drill 1.1 pad 1.88)
  other vias: 44.45,35.56
N$33  (via drill 1.1 pad 1.88)
  other vias: 31.75,33.02
N$34  (via drill 1.1 pad 1.88)
  other vias: 41.91,30.48
N$35  (via drill 1.1 pad 1.88)
  other vias: 29.21,27.94
N$36  (via drill 1.1 pad 1.88)
  other vias: 41.91,25.4
N$37  (via drill 1.1 pad 1.88)
  other vias: 36.83,22.86
N$38  (via drill 1.1 pad 1.88)
  other vias: 41.91,20.32
N$39  (via drill 1.1 pad 1.88)
  other vias: 31.75,17.78
N$40  (via drill 1.1 pad 1.88)
  other vias: 41.91,15.24
N$41
  Top 1.27: R18.P$2 R19.P$2 73.66,19.68 IC2.1
N$42  (via drill 1.1 pad 1.88)
  other vias: 41.91,35.56
N$43  (via drill 1.1 pad 1.88)
  other vias: 41.91,33.02
N$124  (via drill 1.1 pad 1.88)
  other vias: 6.35,48.26
N$125  (via drill 1.1 pad 1.88)
  other vias: 8.89,48.26
N$126
  Top 0.254: LED2.A 12.7,6.35 13.34,6.99 14.61,8.26 23.5,8.26 R13.P$1
N$127
  Bottom 0.254: LED1.A 4.45,6.99 25.4,6.99 27.94,4.45 R14.P$1
N$128  (via drill 1.1 pad 1.88)
  other vias: 11.43,48.26
N$129  (via drill 1.1 pad 1.88)
  other vias: 6.35,50.8
N$130  (via drill 1.1 pad 1.88)
  other vias: 3.81,48.26
N$131  (via drill 1.1 pad 1.88)
  other vias: 19.05,48.26
N$132  (via drill 1.1 pad 1.88)
  other vias: 21.59,50.8
N$133  (via drill 1.1 pad 1.88)
  other vias: 8.89,50.8
N$134  (via drill 1.1 pad 1.88)
  other vias: 11.43,50.8
N$135  (via drill 1.1 pad 1.88)
  other vias: 21.59,48.26
N$136  (via drill 1.1 pad 1.88)
  other vias: 3.81,45.72
N$137  (via drill 1.1 pad 1.88)
  other vias: 19.05,50.8
N$138  (via drill 1.1 pad 1.88)
  other vias: 6.35,45.72
N$139  (via drill 1.1 pad 1.88)
  other vias: 8.89,45.72
N$140  (via drill 1.1 pad 1.88)
  other vias: 11.43,45.72
N$141  (via drill 1.1 pad 1.88)
  other vias: 13.97,48.26
N$142  (via drill 1.1 pad 1.88)
  other vias: 16.51,48.26
N$143  (via drill 1.1 pad 1.88)
  other vias: 21.59,43.18
N$144  (via drill 1.1 pad 1.88)
  other vias: 19.05,43.18
N$145  (via drill 1.1 pad 1.88)
  other vias: 16.51,43.18
N$146  (via drill 1.1 pad 1.88)
  other vias: 13.97,43.18
N$147  (via drill 1.1 pad 1.88)
  other vias: 11.43,43.18
N$148  (via drill 1.1 pad 1.88)
  other vias: 8.89,43.18
N$149  (via drill 1.1 pad 1.88)
  other vias: 3.81,43.18
N$158  (via drill 1.1 pad 1.88)
  other vias: 19.05,45.72
N$161  (via drill 1.1 pad 1.88)
  other vias: 6.35,38.1
N$162  (via drill 1.1 pad 1.88)
  other vias: 3.81,38.1
N$163  (via drill 1.1 pad 1.88)
  other vias: 3.81,33.02
N$164  (via drill 1.1 pad 1.88)
  other vias: 3.81,30.48
N$165  (via drill 1.1 pad 1.88)
  other vias: 3.81,27.94
N$166  (via drill 1.1 pad 1.88)
  other vias: 3.81,25.4
N$167  (via drill 1.1 pad 1.88)
  other vias: 3.81,22.86
N$168  (via drill 1.1 pad 1.88)
  other vias: 6.35,22.86
N$169  (via drill 1.1 pad 1.88)
  other vias: 6.35,25.4
N$170  (via drill 1.1 pad 1.88)
  other vias: 6.35,27.94
N$171  (via drill 1.1 pad 1.88)
  other vias: 6.35,30.48
N$172  (via drill 1.1 pad 1.88)
  other vias: 6.35,33.02
N$173  (via drill 1.1 pad 1.88)
  other vias: 6.35,35.56
N$174  (via drill 1.1 pad 1.88)
  other vias: 3.81,35.56
N$175  (via drill 1.1 pad 1.88)
  other vias: 8.89,38.1
N$176  (via drill 1.1 pad 1.88)
  other vias: 8.89,35.56
N$177  (via drill 1.1 pad 1.88)
  other vias: 11.43,38.1
N$178  (via drill 1.1 pad 1.88)
  other vias: 13.97,38.1
N$179  (via drill 1.1 pad 1.88)
  other vias: 16.51,38.1
N$180  (via drill 1.1 pad 1.88)
  other vias: 19.05,38.1
N$181  (via drill 1.1 pad 1.88)
  other vias: 24.13,38.1
N$182  (via drill 1.1 pad 1.88)
  other vias: 24.13,35.56
N$183  (via drill 1.1 pad 1.88)
  other vias: 21.59,35.56
N$184  (via drill 1.1 pad 1.88)
  other vias: 19.05,35.56
N$185  (via drill 1.1 pad 1.88)
  other vias: 11.43,35.56
N$186  (via drill 1.1 pad 1.88)
  other vias: 13.97,35.56
N$187  (via drill 1.1 pad 1.88)
  other vias: 11.43,33.02
N$188  (via drill 1.1 pad 1.88)
  other vias: 8.89,33.02
N$189  (via drill 1.1 pad 1.88)
  other vias: 13.97,33.02
N$190  (via drill 1.1 pad 1.88)
  other vias: 16.51,33.02
N$191  (via drill 1.1 pad 1.88)
  other vias: 19.05,33.02
N$192  (via drill 1.1 pad 1.88)
  other vias: 24.13,33.02
N$193  (via drill 1.1 pad 1.88)
  other vias: 24.13,30.48
N$194  (via drill 1.1 pad 1.88)
  other vias: 21.59,30.48
N$195  (via drill 1.1 pad 1.88)
  other vias: 19.05,30.48
N$196  (via drill 1.1 pad 1.88)
  other vias: 16.51,30.48
N$197  (via drill 1.1 pad 1.88)
  other vias: 13.97,30.48
N$198  (via drill 1.1 pad 1.88)
  other vias: 8.89,30.48
N$199  (via drill 1.1 pad 1.88)
  other vias: 8.89,27.94
N$200  (via drill 1.1 pad 1.88)
  other vias: 11.43,27.94
N$201  (via drill 1.1 pad 1.88)
  other vias: 13.97,27.94
N$202  (via drill 1.1 pad 1.88)
  other vias: 16.51,27.94
N$203  (via drill 1.1 pad 1.88)
  other vias: 19.05,27.94
N$204  (via drill 1.1 pad 1.88)
  other vias: 24.13,27.94
N$205  (via drill 1.1 pad 1.88)
  other vias: 24.13,25.4
N$206  (via drill 1.1 pad 1.88)
  other vias: 21.59,25.4
N$207  (via drill 1.1 pad 1.88)
  other vias: 19.05,25.4
N$208  (via drill 1.1 pad 1.88)
  other vias: 16.51,25.4
N$209  (via drill 1.1 pad 1.88)
  other vias: 13.97,25.4
N$210  (via drill 1.1 pad 1.88)
  other vias: 8.89,22.86
N$211  (via drill 1.1 pad 1.88)
  other vias: 11.43,22.86
N$212  (via drill 1.1 pad 1.88)
  other vias: 8.89,25.4
N$213  (via drill 1.1 pad 1.88)
  other vias: 13.97,22.86
N$214  (via drill 1.1 pad 1.88)
  other vias: 16.51,22.86
N$215  (via drill 1.1 pad 1.88)
  other vias: 19.05,22.86
N$216  (via drill 1.1 pad 1.88)
  other vias: 24.13,22.86
N$217  (via drill 1.1 pad 1.88)
  other vias: 3.81,20.32
N$218  (via drill 1.1 pad 1.88)
  other vias: 6.35,20.32
N$219  (via drill 1.1 pad 1.88)
  other vias: 8.89,20.32
N$220  (via drill 1.1 pad 1.88)
  other vias: 11.43,20.32
N$221  (via drill 1.1 pad 1.88)
  other vias: 13.97,20.32
N$222  (via drill 1.1 pad 1.88)
  other vias: 16.51,20.32
N$223  (via drill 1.1 pad 1.88)
  other vias: 19.05,20.32
N$224  (via drill 1.1 pad 1.88)
  other vias: 24.13,20.32
N$225  (via drill 1.1 pad 1.88)
  other vias: 24.13,17.78
N$226  (via drill 1.1 pad 1.88)
  other vias: 24.13,15.24
N$227  (via drill 1.1 pad 1.88)
  other vias: 21.59,15.24
N$228  (via drill 1.1 pad 1.88)
  other vias: 19.05,15.24
N$229  (via drill 1.1 pad 1.88)
  other vias: 16.51,15.24
N$230  (via drill 1.1 pad 1.88)
  other vias: 13.97,15.24
N$231  (via drill 1.1 pad 1.88)
  other vias: 11.43,15.24
N$232  (via drill 1.1 pad 1.88)
  other vias: 8.89,15.24
N$233  (via drill 1.1 pad 1.88)
  other vias: 3.81,15.24
N$234  (via drill 1.1 pad 1.88)
  other vias: 26.67,15.24
N$235  (via drill 1.1 pad 1.88)
  other vias: 26.67,17.78
N$236  (via drill 1.1 pad 1.88)
  other vias: 26.67,20.32
N$237  (via drill 1.1 pad 1.88)
  other vias: 26.67,25.4
N$238  (via drill 1.1 pad 1.88)
  other vias: 26.67,30.48
N$239  (via drill 1.1 pad 1.88)
  other vias: 26.67,38.1
N$249  (via drill 1.1 pad 1.88)
  other vias: 29.21,35.56
N$250  (via drill 1.1 pad 1.88)
  other vias: 31.75,35.56
N$251  (via drill 1.1 pad 1.88)
  other vias: 26.67,35.56
N$252  (via drill 1.1 pad 1.88)
  other vias: 26.67,33.02
N$253  (via drill 1.1 pad 1.88)
  other vias: 26.67,22.86
N$254  (via drill 1.1 pad 1.88)
  other vias: 34.29,35.56
N$255  (via drill 1.1 pad 1.88)
  other vias: 36.83,35.56
N$256  (via drill 1.1 pad 1.88)
  other vias: 39.37,35.56
N$271  (via drill 1.1 pad 1.88)
  other vias: 44.45,33.02
N$272  (via drill 1.1 pad 1.88)
  other vias: 39.37,33.02
N$273  (via drill 1.1 pad 1.88)
  other vias: 36.83,33.02
N$274  (via drill 1.1 pad 1.88)
  other vias: 34.29,33.02
N$275  (via drill 1.1 pad 1.88)
  other vias: 29.21,33.02
N$276  (via drill 1.1 pad 1.88)
  other vias: 29.21,30.48
N$277  (via drill 1.1 pad 1.88)
  other vias: 31.75,30.48
N$278  (via drill 1.1 pad 1.88)
  other vias: 34.29,30.48
N$279  (via drill 1.1 pad 1.88)
  other vias: 36.83,30.48
N$280  (via drill 1.1 pad 1.88)
  other vias: 39.37,30.48
N$281  (via drill 1.1 pad 1.88)
  other vias: 44.45,30.48
N$294  (via drill 1.1 pad 1.88)
  other vias: 44.45,27.94
N$295  (via drill 1.1 pad 1.88)
  other vias: 41.91,27.94
N$296  (via drill 1.1 pad 1.88)
  other vias: 39.37,27.94
N$297  (via drill 1.1 pad 1.88)
  other vias: 36.83,27.94
N$298  (via drill 1.1 pad 1.88)
  other vias: 34.29,27.94
N$299  (via drill 1.1 pad 1.88)
  other vias: 31.75,27.94
N$300  (via drill 1.1 pad 1.88)
  other vias: 29.21,25.4
N$301  (via drill 1.1 pad 1.88)
  other vias: 31.75,25.4
N$302  (via drill 1.1 pad 1.88)
  other vias: 36.83,25.4
N$303  (via drill 1.1 pad 1.88)
  other vias: 34.29,25.4
N$304  (via drill 1.1 pad 1.88)
  other vias: 39.37,25.4
N$305  (via drill 1.1 pad 1.88)
  other vias: 44.45,25.4
N$318  (via drill 1.1 pad 1.88)
  other vias: 44.45,22.86
N$319  (via drill 1.1 pad 1.88)
  other vias: 41.91,22.86
N$320  (via drill 1.1 pad 1.88)
  other vias: 39.37,22.86
N$321  (via drill 1.1 pad 1.88)
  other vias: 31.75,22.86
N$322  (via drill 1.1 pad 1.88)
  other vias: 29.21,22.86
N$323  (via drill 1.1 pad 1.88)
  other vias: 34.29,22.86
N$324  (via drill 1.1 pad 1.88)
  other vias: 29.21,20.32
N$325  (via drill 1.1 pad 1.88)
  other vias: 31.75,20.32
N$326  (via drill 1.1 pad 1.88)
  other vias: 34.29,20.32
N$327  (via drill 1.1 pad 1.88)
  other vias: 36.83,20.32
N$328  (via drill 1.1 pad 1.88)
  other vias: 39.37,20.32
N$329  (via drill 1.1 pad 1.88)
  other vias: 44.45,20.32
N$355  (via drill 1.1 pad 1.88)
  other vias: 44.45,17.78
N$356  (via drill 1.1 pad 1.88)
  other vias: 41.91,17.78
N$357  (via drill 1.1 pad 1.88)
  other vias: 39.37,17.78
N$358  (via drill 1.1 pad 1.88)
  other vias: 36.83,17.78
N$359  (via drill 1.1 pad 1.88)
  other vias: 34.29,17.78
N$360  (via drill 1.1 pad 1.88)
  other vias: 31.75,15.24
N$361  (via drill 1.1 pad 1.88)
  other vias: 29.21,17.78
N$362  (via drill 1.1 pad 1.88)
  other vias: 29.21,15.24
N$363  (via drill 1.1 pad 1.88)
  other vias: 34.29,15.24
N$364  (via drill 1.1 pad 1.88)
  other vias: 36.83,15.24
N$365  (via drill 1.1 pad 1.88)
  other vias: 39.37,15.24
N$366  (via drill 1.1 pad 1.88)
  other vias: 44.45,15.24
N$376  (via drill 1.1 pad 1.88)
  other vias: 3.81,17.78
N$377  (via drill 1.1 pad 1.88)
  other vias: 6.35,17.78
N$378  (via drill 1.1 pad 1.88)
  other vias: 8.89,17.78
N$379  (via drill 1.1 pad 1.88)
  other vias: 11.43,17.78
N$380  (via drill 1.1 pad 1.88)
  other vias: 13.97,17.78
N$381  (via drill 1.1 pad 1.88)
  other vias: 16.51,17.78
N$382  (via drill 1.1 pad 1.88)
  other vias: 19.05,17.78
N$384  (via drill 1.1 pad 1.88)
  other vias: 26.67,27.94
RES
  Top 0.254: JP8.1 J52.1 30.48,7.62 | 30.48,7.62 R15.P$1 | 30.48,7.62 28.22,5.36 22.86,5.36 S1.4 S1.3
RX0
  Top 0.254: J11.1 JP2.1
SCL
  Top 0.254: JP3.1 J12.1
SDA
  Top 0.254: J12.2 JP3.2
TX1
  Top 0.254: JP2.2 J11.2

### Text on the board
tPlace: GND | +12V | 20 | 21 | GND | +5V | 23 | 22 | 9 | 8 | 7 | 6 | 5 | 4 | 3 | 2 | 1 | 0 | 24 | 25 | 13 | 12 | 11 | 10 | 14 | 15 | 16 | 17 | 18 | 19 | GND | PWM | 26 | 27 | AREF | TX | RX | TX3 | RX3 | TX2 | RX2 | TX1 | 28 | RX1 | 29 | Relay | Gieger | 30 | 31 | 32 | 33 | 5V | Gieger | 34 | 35 | 36 | 37 | 8/5V | 38 | 39 | 40 | 41 | 42 | 43 | 4/2V | 44 | 45 | 46 | 47 | 48 | 49 | 50 | 51 | 7 Seg Disp | 52 | STAT | POWER | RES | 3V3 | 5V | GND | VIN | 0 | 1 | 2 | 3 | 4 | 5 | 6 | 7 | 8 | 9 | 10 | 11 | 12 | 13 | 14 | 15 | GND | 53 | +5V | RESET